# EAGLE design shield (EAGLE 9.6.2)
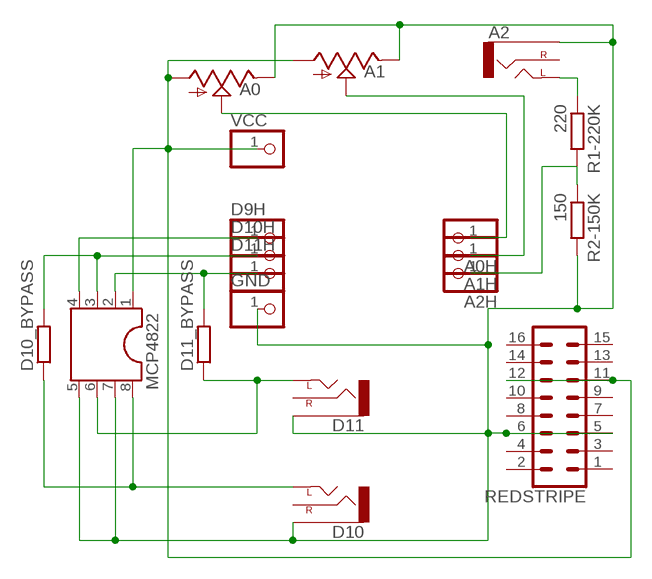
[diagram p0: schematic, sheet 1]

## Parts
A0  9MM_SNAP-IN_POT_  [9MM_SNAP-IN_POT]
A0H  PINHD-1X1  [1X01]
A1  9MM_SNAP-IN_POT_  [9MM_SNAP-IN_POT]
A1H  PINHD-1X1  [1X01]
A2  THONKI-STEREO  [WQP-PJ366ST_JACK]
A2H  PINHD-1X1  [1X01]
D9H  PINHD-1X1  [1X01]
D10  THONKI-STEREO  [WQP-PJ366ST_JACK]
D10_BYPASS  RESISTOR10MM_RESISTOR  [10MM_RESISTOR]
D10H  PINHD-1X1  [1X01]
D11  THONKI-STEREO  [WQP-PJ366ST_JACK]
D11_BYPASS  RESISTOR10MM_RESISTOR  [10MM_RESISTOR]
D11H  PINHD-1X1  [1X01]
GND  PINHD-1X1  [1X01]
MCP4822  DIL8  [DIL08]
R1-220K  220  RESISTOR7MM  [7MM_RESISTOR]
R2-150K  150  RESISTOR7MM  [7MM_RESISTOR]
REDSTRIPE  CONN_08X2  [2X8]
VCC  PINHD-1X1  [1X01]

## Nets
N$1: D10.P$1_TIP(LEFT) D10_BYPASS.1 MCP4822.8
N$2: D11.P$1_TIP(LEFT) D11_BYPASS.1 MCP4822.6
N$3: A0.3(E) A1.3(E) A2.P$3_SLEEVE(SLEEVE) D10.P$3_SLEEVE(SLEEVE) D11.P$3_SLEEVE(SLEEVE) GND.1 MCP4822.5 MCP4822.7 R2-150K.2 REDSTRIPE.5 REDSTRIPE.6
N$4: D9H.1 MCP4822.4
N$5: A2.P$1_TIP(LEFT) R1-220K.1
N$6: A0.1(A) A1.1(A) MCP4822.1 REDSTRIPE.11 REDSTRIPE.12 VCC.1
N$7: A2H.1 R1-220K.2 R2-150K.1
N$8: A1.2(S) A1H.1
N$9: A0.2(S) A0H.1
N$11: D11_BYPASS.2 D11H.1 MCP4822.2
N$12: D10_BYPASS.2 D10H.1 MCP4822.3
Unconnected: A2.P$2_SWITCH(RIGHT) D10.P$2_SWITCH(RIGHT) D11.P$2_SWITCH(RIGHT) REDSTRIPE.1 REDSTRIPE.2 REDSTRIPE.3 REDSTRIPE.4 REDSTRIPE.7 REDSTRIPE.8 REDSTRIPE.9 REDSTRIPE.10 REDSTRIPE.13 REDSTRIPE.14 REDSTRIPE.15 REDSTRIPE.16

## Library data of the parts
A0 A1 = MusicThingModular:9MM_SNAP-IN_POT: 9mm vertical snap-in pot, Alpha / Panasonic style
A0H A1H A2H D9H D10H D11H GND VCC = adafruit:PINHD-1X1: Pin header 1x1 for 0.1" spacing With round pins
A2 D10 D11 = MusicThingModular:THONKI-STEREO: 3.5mm socket for Eurorack modular synths
D10_BYPASS D11_BYPASS R1-220K R2-150K = MusicThingModular:RESISTOR: Standard resistor, various versions
MCP4822 = ic-package:DIL8: Dual In Line / Socket
REDSTRIPE = SparkFun-Connectors:CONN_08X2: Multi connection point. Often used as Generic Header-pin footprint for 0.1 inch spaced/style header connections You can populate with any combo of single row headers, but if you'd like an exact match, check this: Header - 2x8 (Male, 0.1") <https://www.sparkfun.com/products/13156> (PRT-13156) On any of the 0.1 inch spaced packages, you can populate with these: Break Away Headers - Straight <https://www.sparkfun.com/products/116> (PRT-00116) Break Away Male Headers - Right Angle <https://www.sparkfun.com/products/553> (PRT-00553) Female Headers <https://www.sparkfun.com/products/115> (PRT-00115) Break Away Headers - Machine Pin <https://www.sparkfun.com/products/117> (PRT-00117) Break Away Female Headers - Swiss Machine Pin <https://www.sparkfun.com/products/743> (PRT-00743)

## Board
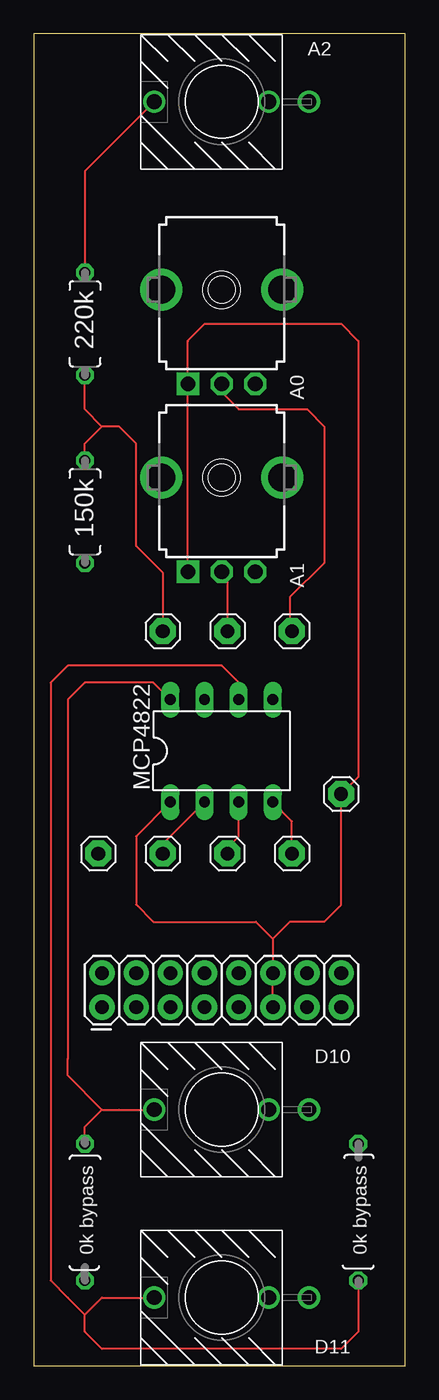
[diagram p1: board, top side]
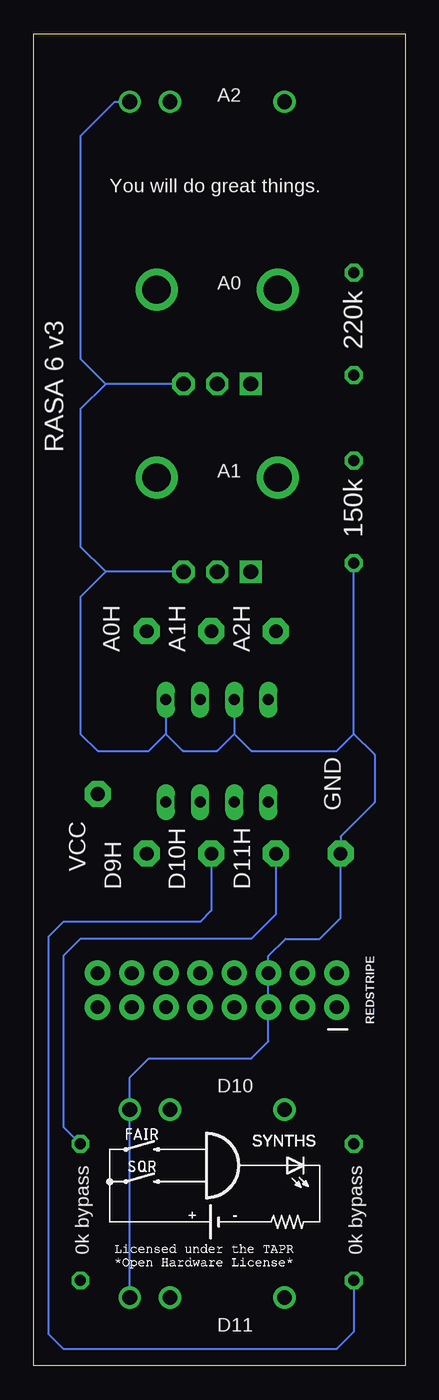
[diagram p2: board, bottom side, seen from below]

Size 27.61 x 99.05 mm. Coordinates in mm from the lower left corner, seen from the top.
Outline: 0,0 27.61,0 27.61,99.05 0,99.05 0,0
Copper layers (1*16): Top 0.035mm / dielectric 1.5mm / Bottom 0.035mm
Design rules "default": minimum track width 6mil, minimum drill 0.35mm, track to track 6mil, track to pad 6mil, pad to pad 6mil, via to via 6mil, smd to smd 6mil, copper to edge 40mil, drill to drill 6mil, minimum pad ring 10mil, minimum via ring 8mil, stop-mask expansion 4mil, vias tented up to drill 0mil, thermal gap 10mil

### Footprints (pad centres in the part's own frame; a part is rotated, then mirrored left to right if it is on the bottom)
9MM_SNAP-IN_POT = drill 1.1 square: 1 -2.5,-7 | drill 1.1 octagon: 2 0,-7; 3 2.5,-7 | drill 2.1 pad 2.794: CHASSIS1 -4.5,0; CHASSIS2 4.5,0
1X01 = drill 1.016 pad 1.93 octagon: 1 0,0
WQP-PJ366ST_JACK = drill 1.1: P$1_TIP 0,5; P$2_SWITCH 0,-3.5; P$3_SLEEVE 0,-6.5
10MM_RESISTOR = drill 0.813 octagon: 1 -5.08,0; 2 5.08,0
DIL08 = drill 0.813 long: 1 -3.81,-3.81; 2 -1.27,-3.81; 3 1.27,-3.81; 4 3.81,-3.81; 5 3.81,3.81; 6 1.27,3.81; 7 -1.27,3.81; 8 -3.81,3.81
7MM_RESISTOR = drill 0.813 octagon: 1 -3.81,0; 2 3.81,0
2X8 = drill 1.016 pad 1.88: 1 0,0; 2 0,2.54; 3 2.54,0; 4 2.54,2.54; 5 5.08,0; 6 5.08,2.54; 7 7.62,0; 8 7.62,2.54; 9 10.16,0; 10 10.16,2.54; 11 12.7,0; 12 12.7,2.54; 13 15.24,0; 14 15.24,2.54; 15 17.78,0; 16 17.78,2.54

### Placement (x,y rotation side)
A0  13.97,80.01 0 top
A0H  19.2,54.62 0 top
A1  13.97,66.04 0 top
A1H  14.4,54.62 0 top
A2  13.97,93.98 90 top
A2H  9.6,54.62 0 top
D9H  19.2,38.09 0 top
D10  13.97,19.05 90 top
D10_BYPASS  3.81,11.43 270 top
D10H  14.4,38.09 0 top
D11  13.97,5.08 90 top
D11_BYPASS  24.13,11.43 90 top
D11H  9.6,38.09 0 top
GND  4.8,38.09 0 top
MCP4822  13.97,45.72 0 top
R1-220K  3.81,77.47 270 top
R2-150K  3.81,63.5 270 top
REDSTRIPE  5.08,26.67 0 top
VCC  22.85,42.52 0 top

### Tracks (layer width: path | path; a pad name or v marks a point on that pad's centre or on a via)
N$1
  Top 0.152: MCP4822.8 8.89,50.8 3.81,50.8 2.54,49.53 2.54,22.86 2.54,21.59 5.08,19.05 | D10.P$1_TIP 6.35,19.05 5.08,19.05 | D10_BYPASS.1 3.81,17.78 5.08,19.05
N$2
  Top 0.152: MCP4822.6 15.24,50.8 13.97,52.07 2.54,52.07 1.27,50.8 1.27,6.35 2.54,5.08 3.81,3.81 | D11.P$1_TIP 5.08,5.08 3.81,3.81 | D11_BYPASS.1 24.13,2.54 22.86,1.27 5.08,1.27 3.81,2.54 3.81,3.81
N$3
  Bottom 0.152: D11.P$3_SLEEVE D10.P$3_SLEEVE 20.47,21.44 19.05,22.86 11.43,22.86 10.16,24.13 REDSTRIPE.5 REDSTRIPE.6 10.16,30.48 8.89,31.75 6.35,31.75 4.8,33.3 GND.1 4.8,39.36 2.26,41.9 2.26,45.44 3.81,46.99 | 3.81,46.99 5.08,45.72 11.43,45.72 12.7,46.99 | 3.81,46.99 R2-150K.2 | A2.P$3_SLEEVE 21.59,93.98 24.13,91.44 24.13,74.9 22.24,73.01 | A1.3 22.24,59.04 | 22.24,59.04 24.13,57.15 24.13,46.99 22.86,45.72 19.05,45.72 17.78,46.99 | A0.3 22.24,73.01 | 22.24,73.01 24.13,71.12 24.13,60.93 22.24,59.04 | MCP4822.7 12.7,46.99 | 12.7,46.99 13.97,45.72 16.51,45.72 17.78,46.99 | MCP4822.5 17.78,46.99
N$4
  Top 0.152: D9H.1 19.2,40.49 MCP4822.4
N$5
  Top 0.152: A2.P$1_TIP 3.81,88.82 R1-220K.1
N$6
  Top 0.152: A1.1 A0.1 11.47,76.16 11.43,76.2 12.7,77.47 22.86,77.47 24.13,76.2 24.13,43.8 VCC.1 22.85,34.28 21.59,33.02 19.05,33.02 17.78,31.75 | REDSTRIPE.11 REDSTRIPE.12 17.78,31.75 | MCP4822.1 7.62,39.37 7.62,34.29 8.89,33.02 16.51,33.02 17.78,31.75
N$7
  Top 0.152: R2-150K.1 3.81,68.58 5.08,69.85 | R1-220K.2 3.81,71.12 5.08,69.85 | 5.08,69.85 6.35,69.85 7.62,68.58 7.62,60.96 9.6,58.98 A2H.1
N$8
  Top 0.152: A1.2 14.4,58.61 A1H.1
N$9
  Top 0.152: A0.2 13.97,72.39 15.24,71.12 20.32,71.12 21.59,69.85 21.59,59.69 19.05,57.15 19.05,54.77 A0H.1
N$11
  Top 0.152: D11H.1 9.6,38.81 MCP4822.2
  Bottom 0.152: D11H.1 9.6,33.58 11.43,31.75 24.13,31.75 25.4,30.48 25.4,17.78 D11_BYPASS.2
N$12
  Top 0.152: D10H.1 14.4,38.53 15.24,39.37 MCP4822.3
  Bottom 0.152: D10H.1 14.4,33.86 15.24,33.02 25.4,33.02 26.52,31.9 26.52,2.39 25.4,1.27 5.08,1.27 3.81,2.54 D10_BYPASS.2

### Text on the board
tPlace: 220k | 150k | 0k bypass | 0k bypass
bPlace: 220k | RASA 6 v3 | 150k | 0k bypass | 0k bypass
bNames: A2 | You will do great things. | A0 | A1 | D10 | D11